# Altium schematic sheet Peripherals.SchDoc: main_assy PCB
size A4
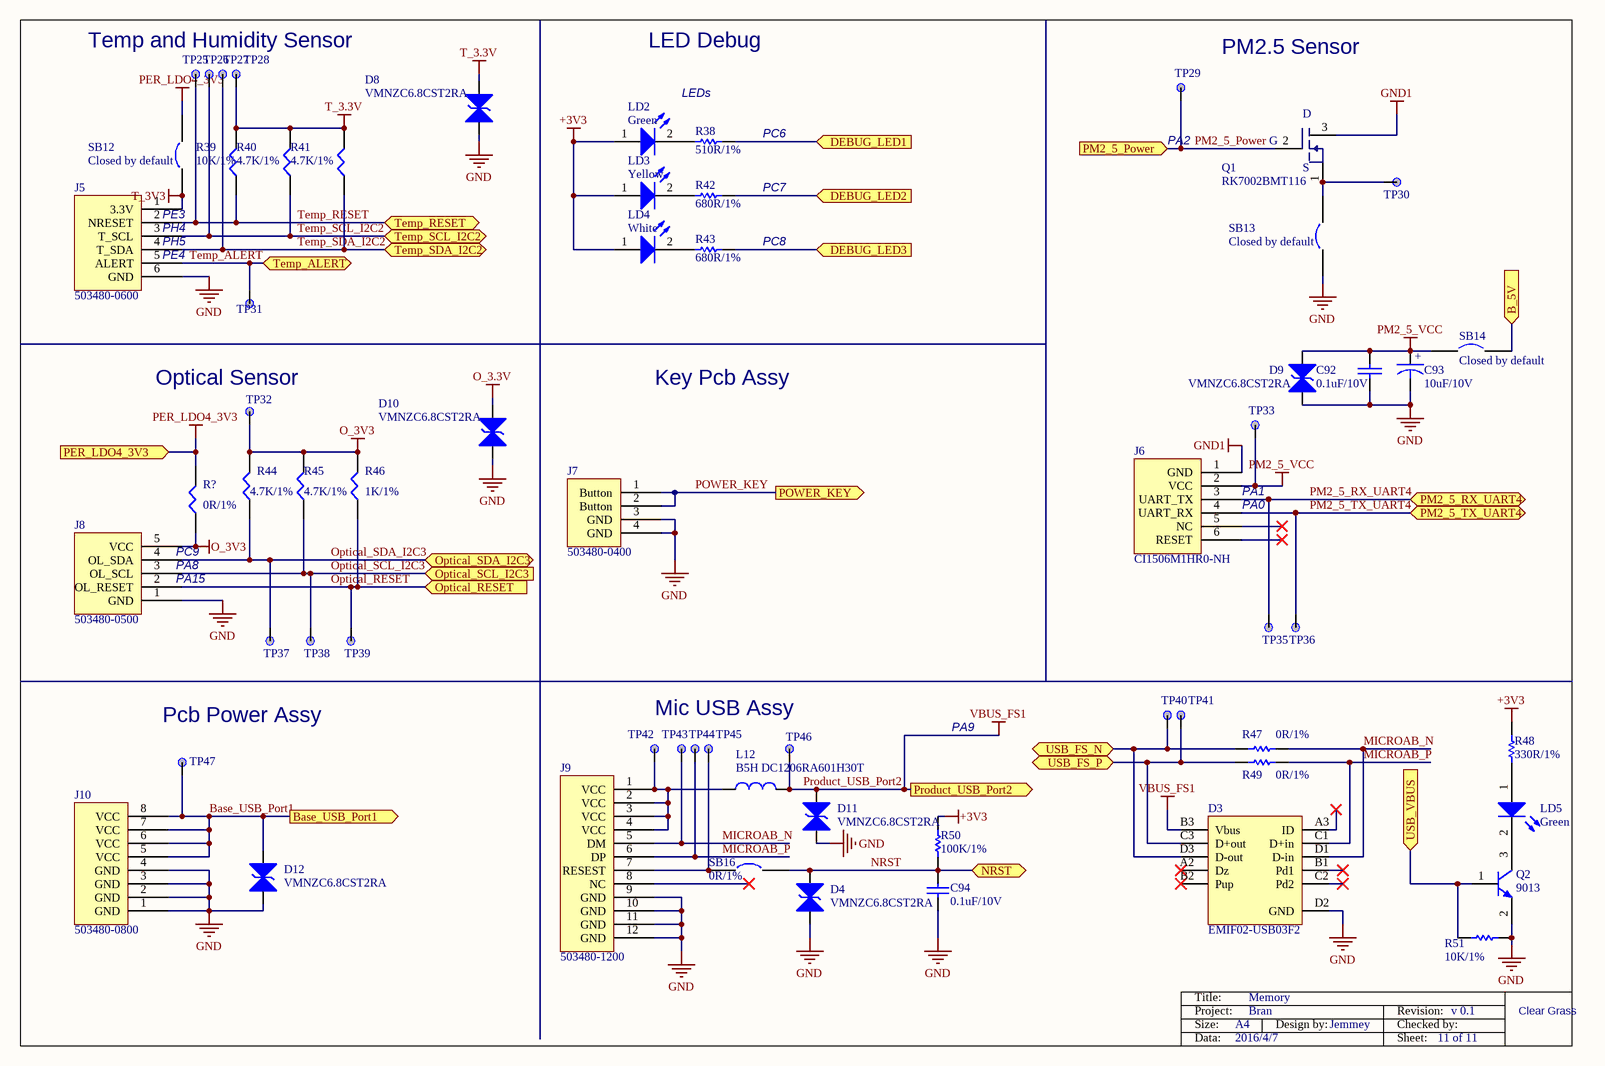
[diagram p0: Peripherals.SchDoc]

## Parts
C92  0.1uF/10V  [0402C]
C93  10uF/10V  [6032]
C94  0.1uF/10V  [0402C]
D3  EMIF02-USB03F2  [BGA11_0R5_1R57X2R07]
D4  VMNZC6.8CST2RA  [0402]
D8  VMNZC6.8CST2RA  [0402]
D9  VMNZC6.8CST2RA  [0402]
D10  VMNZC6.8CST2RA  [0402]
D11  VMNZC6.8CST2RA  [0402]
D12  VMNZC6.8CST2RA  [0402]
J5  503480-0600
J6  CI1506M1HR0-NH
J7  503480-0400
J8  503480-0500
J9  503480-1200
J10  503480-0800
L12  B5H DC1206RA601H30T  [1206]
LD2  Green  [0603D]
LD3  Yellow  [0603D]
LD4  White  [0603D]
LD5  Green  [0603D]
Q1  RK7002BMT116  [SOT23]
Q2  9013  [SOT-23]
R38  510R/1%  [0402R]
R39  10K/1%  [0402R]
R40  4.7K/1%  [0402R]
R41  4.7K/1%  [0402R]
R42  680R/1%  [0402R]
R43  680R/1%  [0402R]
R44  4.7K/1%  [0402R]
R45  4.7K/1%  [0402R]
R46  1K/1%  [0402R]
R47  0R/1%  [0603R]
R48  330R/1%  [0402R]
R49  0R/1%  [0603R]
R50  100K/1%  [0402R]
R51  10K/1%  [0402R]
R?  0R/1%  [0402R]
SB12  Closed by default  [0603R]
SB13  Closed by default  [0603R]
SB14  Closed by default  [0603R]
SB16  0R/1%  [0603R]
TP25  TP  [TP_C40]  (value not drawn)
TP26  TP  [TP_C40]  (value not drawn)
TP27  TP  [TP_C40]  (value not drawn)
TP28  TP  [TP_C40]  (value not drawn)
TP29  TP  [TP_C40]  (value not drawn)
TP30  TP  [TP_C40]  (value not drawn)
TP31  TP  [TP_C40]  (value not drawn)
TP32  TP  [TP_C40]  (value not drawn)
TP33  TP  [TP_C40]  (value not drawn)
TP35  TP  [TP_C40]  (value not drawn)
TP36  TP  [TP_C40]  (value not drawn)
TP37  TP  [TP_C40]  (value not drawn)
TP38  TP  [TP_C40]  (value not drawn)
TP39  TP  [TP_C40]  (value not drawn)
TP40  TP  [TP_C40]  (value not drawn)
TP41  TP  [TP_C40]  (value not drawn)
TP42  TP  [TP_C40]  (value not drawn)
TP43  TP  [TP_C40]  (value not drawn)
TP44  TP  [TP_C40]  (value not drawn)
TP45  TP  [TP_C40]  (value not drawn)
TP46  TP  [TP_C40]  (value not drawn)
TP47  TP  [TP_C40]  (value not drawn)

## Ports
B_5V (in), Base_USB_Port1 (out), DEBUG_LED1 (in), DEBUG_LED2 (in), DEBUG_LED3 (in), NRST (bidir), Optical_RESET (in), Optical_SCL_I2C3 (in), Optical_SDA_I2C3 (bidir), PER_LDO4_3V3 (in), PM2_5_Power (in), PM2_5_RX_UART4 (bidir), PM2_5_TX_UART4 (bidir), POWER_KEY (out), Product_USB_Port2 (out), Temp_ALERT (bidir), Temp_RESET (bidir), Temp_SCL_I2C2 (bidir), Temp_SDA_I2C2 (bidir), USB_FS_N (bidir), USB_FS_P (bidir), USB_VBUS (in)

## Nets
+3V3: LD2.1(A) LD3.1(A) LD4.1(A) R48.2 R50.1
GND: C92.1 C93.2 C94.1 D3.D2(GND) D4.1(Diode1) D8.1(Diode1) D9.1(Diode1) D10.1(Diode1) D11.1(Diode1) D12.1(Diode1) J5.6(GND) J7.3(GND) J7.4(GND) J8.1(GND) J9.9(GND) J9.10(GND) J9.11(GND) J9.12(GND) J10.1(GND) J10.2(GND) J10.3(GND) J10.4(GND) Q2.2(E) R51.1 SB13.1
GND1: J6.1(GND) Q1.3(D)
O_3.3V: D10.2(dIode2)
O_3V3: J8.5(VCC) R44.2 R45.2 R46.2 R?.1 TP32.1
PER_LDO4_3V3: R?.2 SB12.2 ; port PER_LDO4_3V3
PM2_5_VCC: C92.2 C93.1 D9.2(dIode2) J6.2(VCC) SB14.1 TP33.1
Product_USB_Port2: D3.B3(Vbus) D11.2(dIode2) L12.2 TP46.1 ; port Product_USB_Port2  [also labelled VBUS_FS1]
T_3.3V: D8.2(dIode2) R39.2 R40.2 R41.2 TP28.1
T_3V3: J5.1(3.3V) SB12.1
B_5V: SB14.2 ; port B_5V
Base_USB_Port1: D12.2(dIode2) J10.5(VCC) J10.6(VCC) J10.7(VCC) J10.8(VCC) TP47.1 ; port Base_USB_Port1
DEBUG_LED1: R38.1 ; port DEBUG_LED1
DEBUG_LED2: R42.1 ; port DEBUG_LED2
DEBUG_LED3: R43.1 ; port DEBUG_LED3
MICROAB_N: D3.C1(D+in) D3.D1(D-in) J9.5(DM) J9.6(DP) R47.2 R49.2 TP43.1 TP44.1  [also labelled MICROAB_P]
NRST: C94.2 D4.2(dIode2) R50.2 SB16.2 ; port NRST
Optical_RESET: J8.2(OL_RESET) R46.1 TP39.1 ; port Optical_RESET
Optical_SCL_I2C3: J8.3(OL_SCL) R45.1 TP38.1 ; port Optical_SCL_I2C3
Optical_SDA_I2C3: J8.4(OL_SDA) R44.1 TP37.1 ; port Optical_SDA_I2C3
PM2_5_Power: Q1.2(G) TP29.1 ; port PM2_5_Power
PM2_5_RX_UART4: J6.3(UART_TX) TP35.1 ; port PM2_5_RX_UART4
PM2_5_TX_UART4: J6.4(UART_RX) TP36.1 ; port PM2_5_TX_UART4
POWER_KEY: J7.1(Button) J7.2(Button) ; port POWER_KEY
Temp_ALERT: J5.5(ALERT) TP31.1 ; port Temp_ALERT
Temp_RESET: J5.2(NRESET) R39.1 TP25.1 ; port Temp_RESET
Temp_SCL_I2C2: J5.3(T_SCL) R40.1 TP26.1 ; port Temp_SCL_I2C2
Temp_SDA_I2C2: J5.4(T_SDA) R41.1 TP27.1 ; port Temp_SDA_I2C2
USB_FS_N: D3.D3(D-out) R47.1 TP40.1 ; port USB_FS_N
USB_FS_P: D3.C3(D+out) R49.1 TP41.1 ; port USB_FS_P
USB_VBUS: Q2.1(B) R51.2 ; port USB_VBUS
NetJ9_1: J9.1(VCC) J9.2(VCC) J9.3(VCC) J9.4(VCC) L12.1 TP42.1
NetJ9_7: J9.7(RESEST) SB16.1 TP45.1
NetLD2_2: LD2.2(K) R38.2
NetLD3_2: LD3.2(K) R42.2
NetLD4_2: LD4.2(K) R43.2
NetLD5_1: LD5.1(A) R48.1
NetLD5_2: LD5.2(K) Q2.3(C)
NetQ1_1: Q1.1(S) SB13.2 TP30.1

Not connected (* = marked no-connect by the designer): D3 A2(Dz)* A3(ID)* B1(Pd1)* B2(Pup)* C2(Pd2)*; J6 5(NC)* 6(RESET)*; J9 8(NC)*

## Notes on the sheet
- Temp and Humidity Sensor
- LED Debug
- PM2.5 Sensor
- LEDs
- (near R38) PC6
- PC7
- (near TP29) PA2
- (near J5) PE4
- (near J5) PE3
- (near J5) PH4
- (near J5) PH5
- PC8
- (near TP32) Optical Sensor
- Key Pcb Assy
- (near J6) PA0
- PA1
- PC9
- PA8
- (near J8) PA15
- (near TP47) Pcb Power Assy
- Mic USB Assy
- PA9
- Title:
- Memory
- Project:
- Size:
- Data:
- A4
- 2016/4/7
- Bran
- Design by:
- Jemmey
- Revision:
- Sheet:
- Checked by:
- 11 of 11
- v 0.1
- Clear Grass
- (in symbol Capacitor) +

## Library data of the parts
C92 = CAP: 厂家：Murata，型号：GRM155R71A104KA01D
C93 = Capacitor
C94 = CAP: Capacitor; Value: 100pF; Ordered by: Subcon; Published: 8-Jun-2000; Revision: July-2002: Re-released for DXP Platform.; Publisher: Altium Limited
D3 = EMIF02-USB03F2: 2-line IPAD, EMI filter including ESD protection; Manuf_1: ST; ECCN_US/EU: EAR99/NEC; Ref St: 9179037; Order: EMIF02-USB03F2; Manuf_Part_1: EMIF02-USB03F2; Provided: ST; Distrib: ST; Ordered by: ST
D4 D8-D12 = ESD_1: 厂家：ROHM，型号：VMNZC6.8CST2RA
J5 = 503480-0600: 厂家：Molex，型号：503480-0600
J6 = CI15: 厂家：瀚荃股份，型号：CI1506M1HR0-NH
J7 = 503480-0400: 厂家：Molex，型号：503480-0400
J8 = 503480-0500: 厂家：Molex，型号：503480-0500
J9 = 503480-1200: 厂家：Molex，型号：503480-1200
J10 = 503480-0800: 厂家：Molex，型号：503480-0800
L12 = CHOKE: 厂家：宇磁，型号：B5H DC1206RA601H30T
LD2-LD4 = LED2: Typical RED, GREEN, YELLOW, AMBER GaAs LED; Ordered by: Subcon; ECCN_US/EU: EAR99/NEC; Published: 8-Jun-2000; Revision: July-2002: Re-released for DXP Platform.; Publisher: Altium Limited
LD5 = LED2: Typical RED, GREEN, YELLOW, AMBER GaAs LED; Ordered by: Subcon; ECCN_US/EU: EAR99/NEC; Silkscreen: VBUS; Published: 8-Jun-2000; Revision: July-2002: Re-released for DXP Platform.; Publisher: Altium Limited
Q1 = RK7002: 厂家：ROHM，型号：RK7002BMT116
Q2 = NPN: NPN Bipolar Transistor; Manuf_Part_1: MMBT9013; Code - JEDEC: TO-226-AA; Ordered by: Subcon; ECCN_US/EU: EAR99/NEC; Published: 8-Jun-2000; Revision: July-2002: Re-released for DXP Platform.; Publisher: Altium Limited
R38 R42 R43 R47 R49 = Res1: Resistor; Value: 1K; Ordered by: Subcon; Published: 8-Jun-2000; Revision: July-2002: Re-released for DXP Platform.; Publisher: Altium Limited
R39 R40 R44 R45 R? = RES1: 厂家：Yageo，型号：
R41 R46 = RES1: 厂家：Yageo，型号：RC0402FR-0710KL
R48 = res1: Resistor; Value: 1K; Ordered by: Subcon; Published: 8-Jun-2000; Revision: July-2002: Re-released for DXP Platform.; Publisher: Altium Limited
R50 = res1: 厂家：Yageo，型号：RC0402FR-07100KL; Value: 1K; Ordered by: Subcon; Published: 8-Jun-2000; Revision: July-2002: Re-released for DXP Platform.; Publisher: Altium Limited
R51 = res1: 厂家：Yageo，型号：RC0402FR-0710KL; Value: 1K; Ordered by: Subcon; Published: 8-Jun-2000; Revision: July-2002: Re-released for DXP Platform.; Publisher: Altium Limited
SB12-SB14 = Circuit Breaker: Ordered by: Subcon; Comments: Solder bridge; Fitted: NO; Published: 24-Mar-1999; Revision: July-2002: Re-released for DXP Platform.; Publisher: Altium Limited
SB16 = Circuit Breaker: Ordered by: Subcon; Comments: Solder bridge; Published: 24-Mar-1999; Revision: July-2002: Re-released for DXP Platform.; Publisher: Altium Limited
TP25-TP33 TP35-TP47 = TP: Ordered by: Subcon